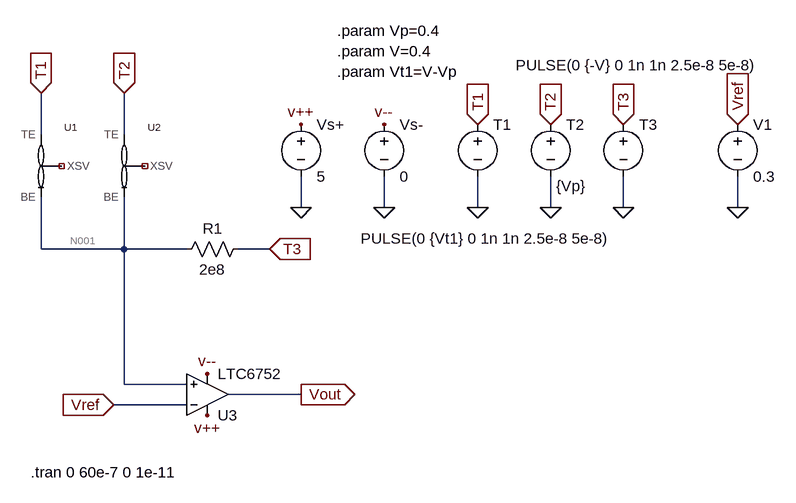
[diagram p0: schematic 16逻辑.asc]
16逻辑.asc, the LTspice schematic file:
Version 4
SHEET 1 1536 744
WIRE 176 208 176 144
WIRE 304 208 304 144
WIRE 576 320 576 272
WIRE 704 320 704 272
WIRE 848 320 848 272
WIRE 960 320 960 272
WIRE 1072 320 1072 272
WIRE 1248 320 1248 272
WIRE 176 384 176 304
WIRE 304 384 304 304
WIRE 304 384 176 384
WIRE 400 384 304 384
WIRE 528 384 480 384
WIRE 304 592 304 384
WIRE 400 592 304 592
WIRE 576 608 464 608
WIRE 400 624 288 624
FLAG 176 144 T1
IOPIN 176 144 In
FLAG 304 144 T2
IOPIN 304 144 In
FLAG 528 384 T3
IOPIN 528 384 In
FLAG 576 320 0
FLAG 704 320 0
FLAG 576 192 v++
FLAG 704 192 v--
FLAG 848 320 0
FLAG 960 320 0
FLAG 1072 320 0
FLAG 848 192 T1
IOPIN 848 192 In
FLAG 960 192 T2
IOPIN 960 192 In
FLAG 1072 192 T3
IOPIN 1072 192 In
FLAG 576 608 Vout
IOPIN 576 608 Out
FLAG 288 624 Vref
IOPIN 288 624 In
FLAG 1248 320 0
FLAG 1248 192 Vref
IOPIN 1248 192 In
FLAG 432 640 v++
FLAG 432 576 v--
SYMBOL res 496 368 R90
WINDOW 0 0 56 VBottom 2
WINDOW 3 32 56 VTop 2
SYMATTR InstName R1
SYMATTR Value 2e8
SYMBOL voltage 576 176 R0
WINDOW 123 0 0 Left 0
WINDOW 39 0 0 Left 0
SYMATTR InstName Vs+
SYMATTR Value 5
SYMBOL voltage 704 176 R0
WINDOW 123 0 0 Left 0
WINDOW 39 0 0 Left 0
SYMATTR InstName Vs-
SYMATTR Value 0
SYMBOL voltage 848 176 R0
WINDOW 3 -180 192 Left 2
WINDOW 123 0 0 Left 0
WINDOW 39 0 0 Left 0
SYMATTR Value PULSE(0 {Vt1} 0 1n 1n 2.5e-8 5e-8)
SYMATTR InstName T1
SYMBOL voltage 960 176 R0
WINDOW 3 9 111 Left 2
WINDOW 123 0 0 Left 0
WINDOW 39 0 0 Left 0
SYMATTR Value {Vp}
SYMATTR InstName T2
SYMBOL voltage 1072 176 R0
WINDOW 3 -166 -75 Left 2
WINDOW 123 0 0 Left 0
WINDOW 39 0 0 Left 0
SYMATTR Value PULSE(0 {-V} 0 1n 1n 2.5e-8 5e-8)
SYMATTR InstName T3
SYMBOL voltage 1248 176 R0
WINDOW 123 0 0 Left 0
WINDOW 39 0 0 Left 0
SYMATTR InstName V1
SYMATTR Value 0.3
SYMBOL Comparators\\LTC6752 432 672 M180
SYMATTR InstName U3
SYMBOL MEM_YAKOPCIC 176 256 R0
SYMATTR InstName U1
SYMBOL MEM_YAKOPCIC 304 256 R0
SYMATTR InstName U2
TEXT 632 48 Left 2 !.param Vp=0.4\n.param V=0.4\n.param Vt1=V-Vp
TEXT 160 728 Left 2 !.tran 0 60e-7 0 1e-11

The netlist it stands for:
* 16逻辑.asc
R1 T3 N001 2e8
Vs+ v++ 0 5
Vs- v-- 0 0
V§T1 T1 0 PULSE(0 {Vt1} 0 1n 1n 2.5e-8 5e-8)
V§T2 T2 0 {Vp}
V§T3 T3 0 PULSE(0 {-V} 0 1n 1n 2.5e-8 5e-8)
V1 Vref 0 0.3
XU3 N001 Vref v++ v-- Vout LTC6752  ; pins In+ In- V+ V- OUT
XU1 T1 N001 NC_01 MEM_YAKOPCIC  ; pins TE BE XSV
XU2 T2 N001 NC_02 MEM_YAKOPCIC  ; pins TE BE XSV
.param Vp=0.4
.param V=0.4
.param Vt1=V-Vp
.tran 0 60e-7 0 1e-11
.lib LTC7.lib
.lib MEM_YAKOPCIC.sub
.backanno
.end

* Results of the author's LTspice run, read from the files saved beside the schematic
* Operating Point, zero values left out:
*   V(n001) = 200.2 mV
*   V(v++) = 5 V
*   V(t2) = 400 mV
*   V(vref) = 300 mV
*   V(vout) = 71.52 nV
*   I(R1) = -1.001 nA
*   I(Vs+) = -5.448 mA
*   I(Vs-) = 5.445 mA
*   I(T1) = 1.499 mA
*   I(T2) = -1.496 mA
*   I(T3) = 1.001 nA
*   I(V1) = 894.9 nA
*   Ix(u3:1) = -2.466 µA
*   Ix(u3:2) = -894.9 nA
*   Ix(u3:3) = 5.448 mA
*   Ix(u3:4) = -5.445 mA
*   Ix(u3:5) = 5 pA
*   Ix(u1:TE) = -1.499 mA
*   Ix(u1:BE) = 1.499 mA
*   Ix(u2:TE) = 1.496 mA
*   Ix(u2:BE) = -1.496 mA
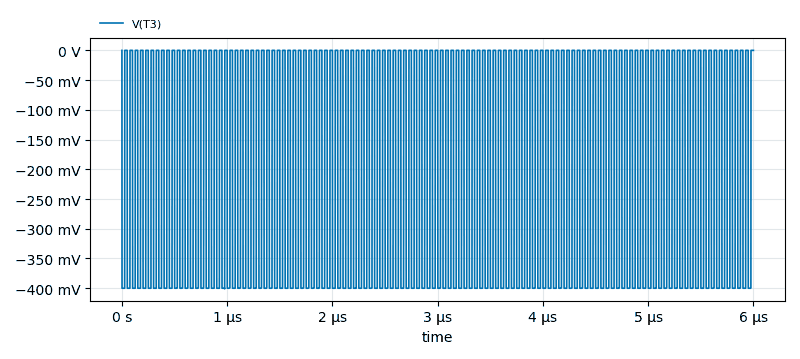
[diagram p1: Transient Analysis of 16逻辑.asc, plotted from the saved traces]
* Transient Analysis, 1 run:
*   V(T3): min -401 mV, max 0 V, average -208 mV, rms 288.3 mV, last 0 V